# EAGLE design rooftop_reflector_v1.3 (EAGLE 9.6.2)
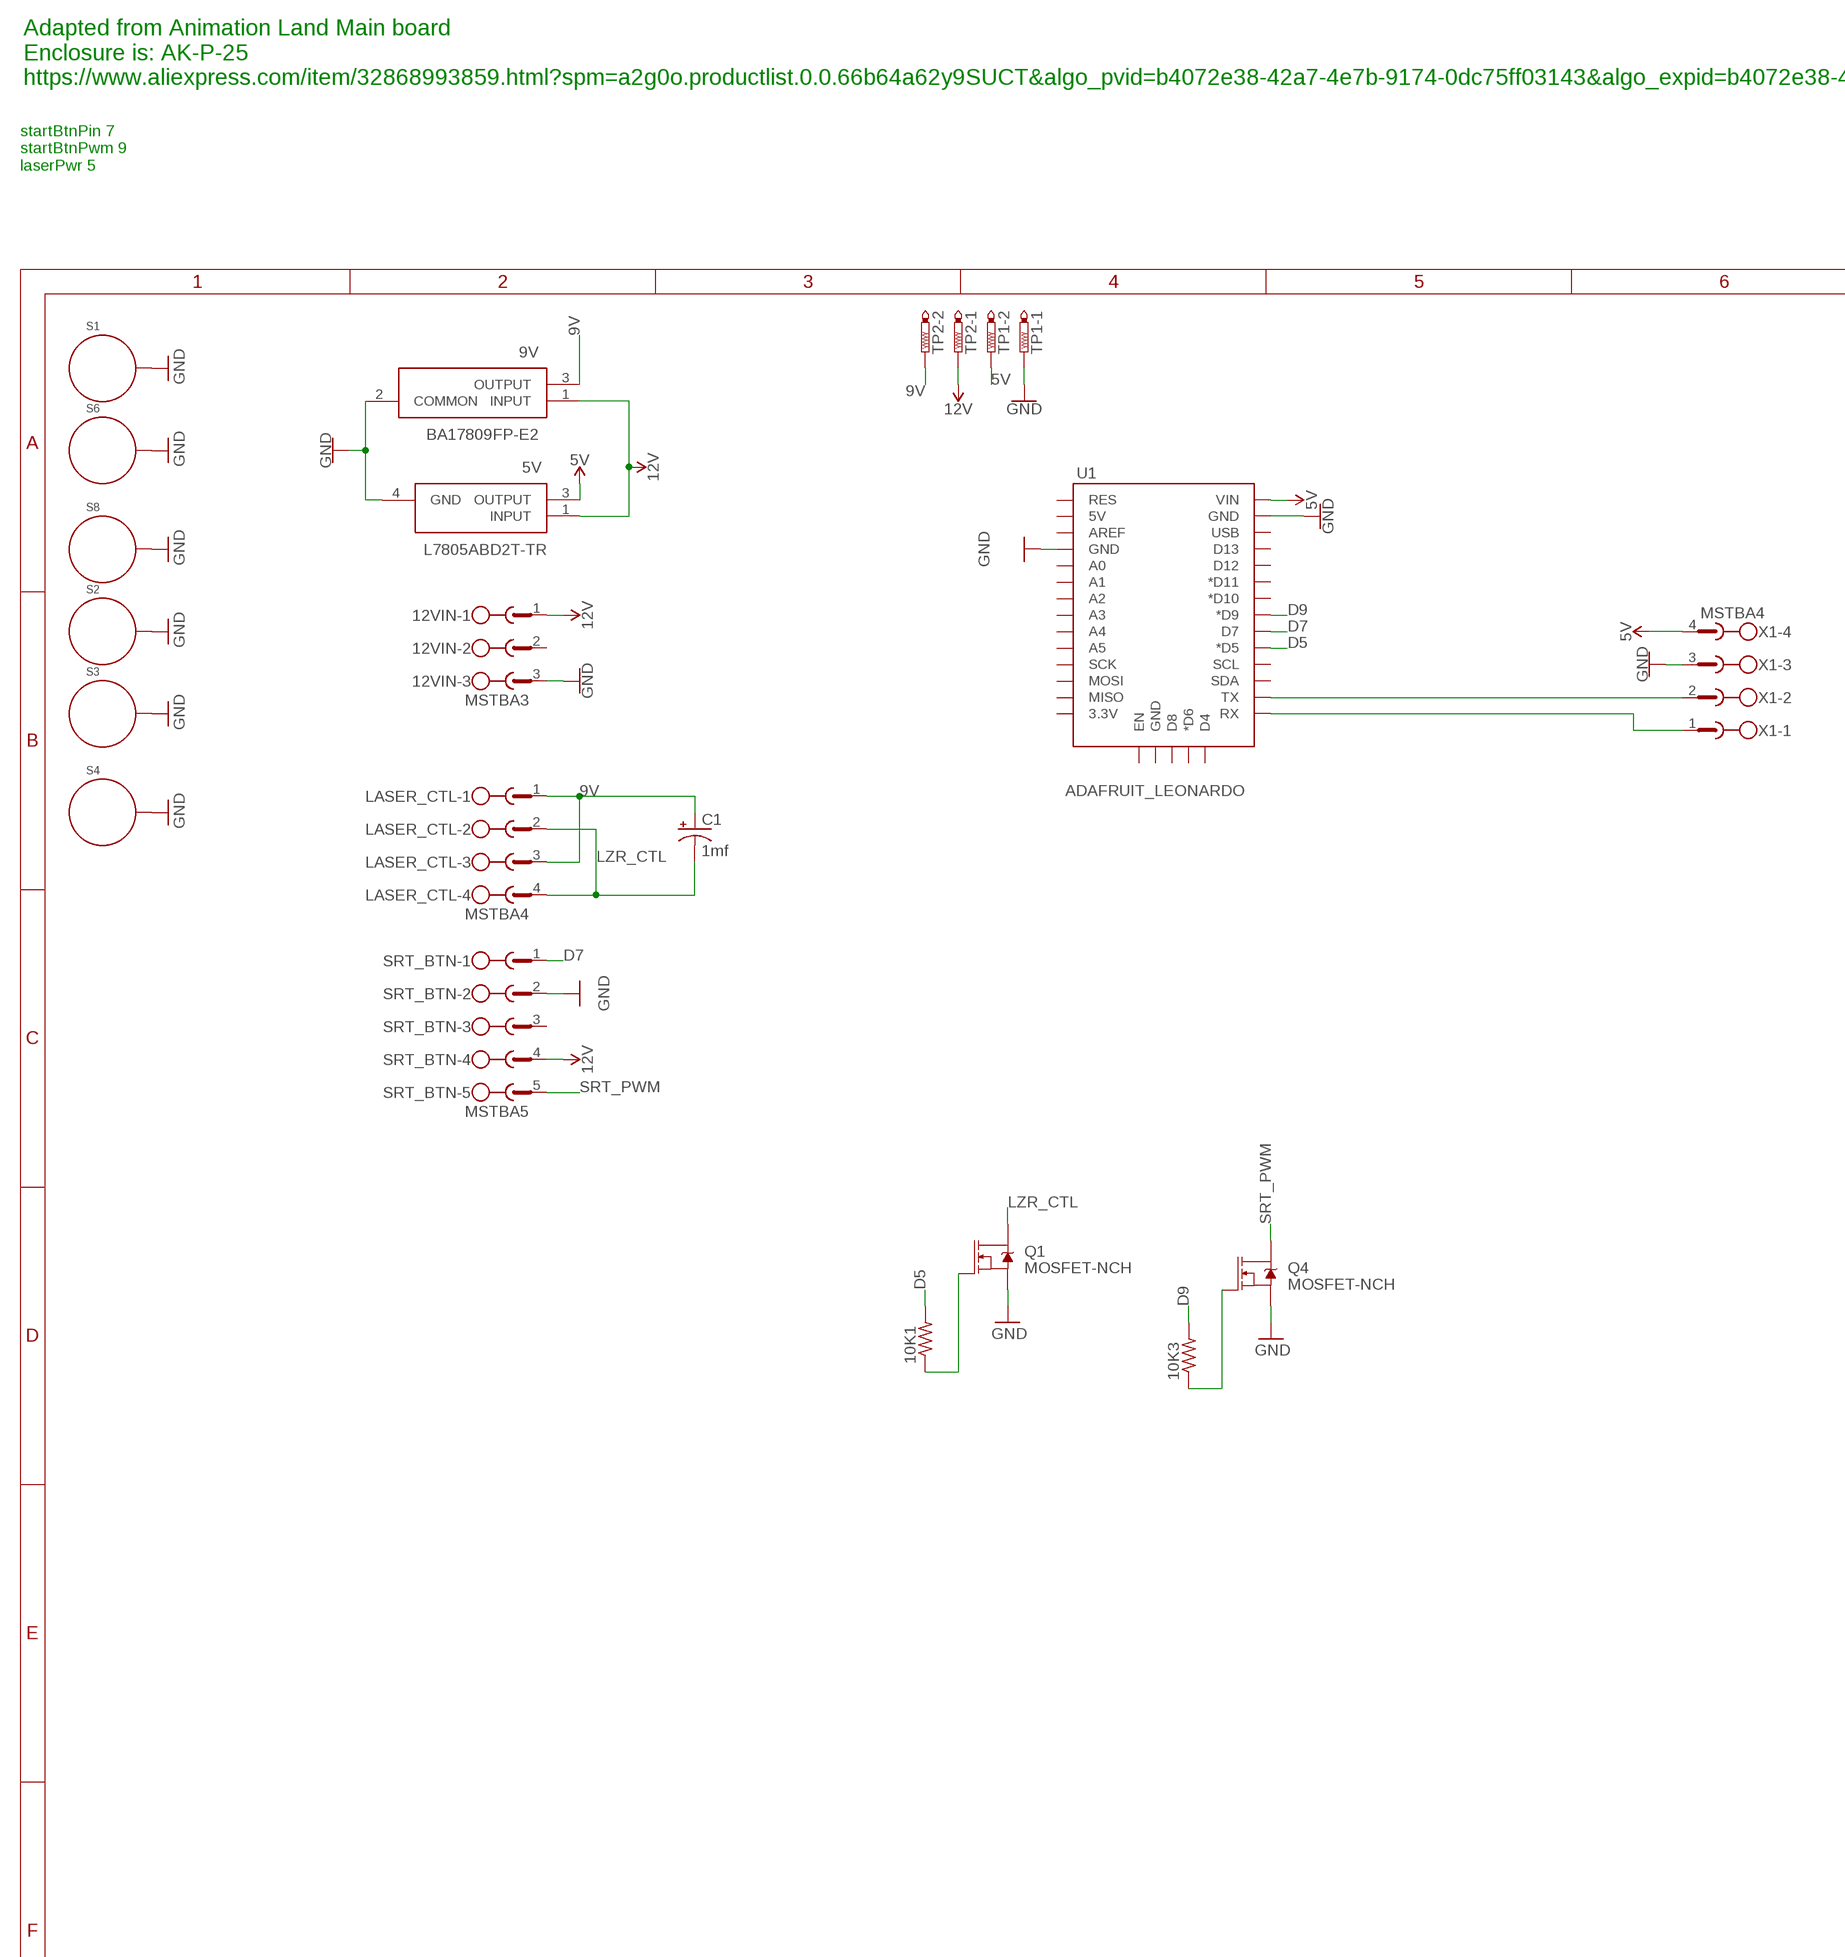
[diagram p0: schematic, sheet 1, part 1 of 2]
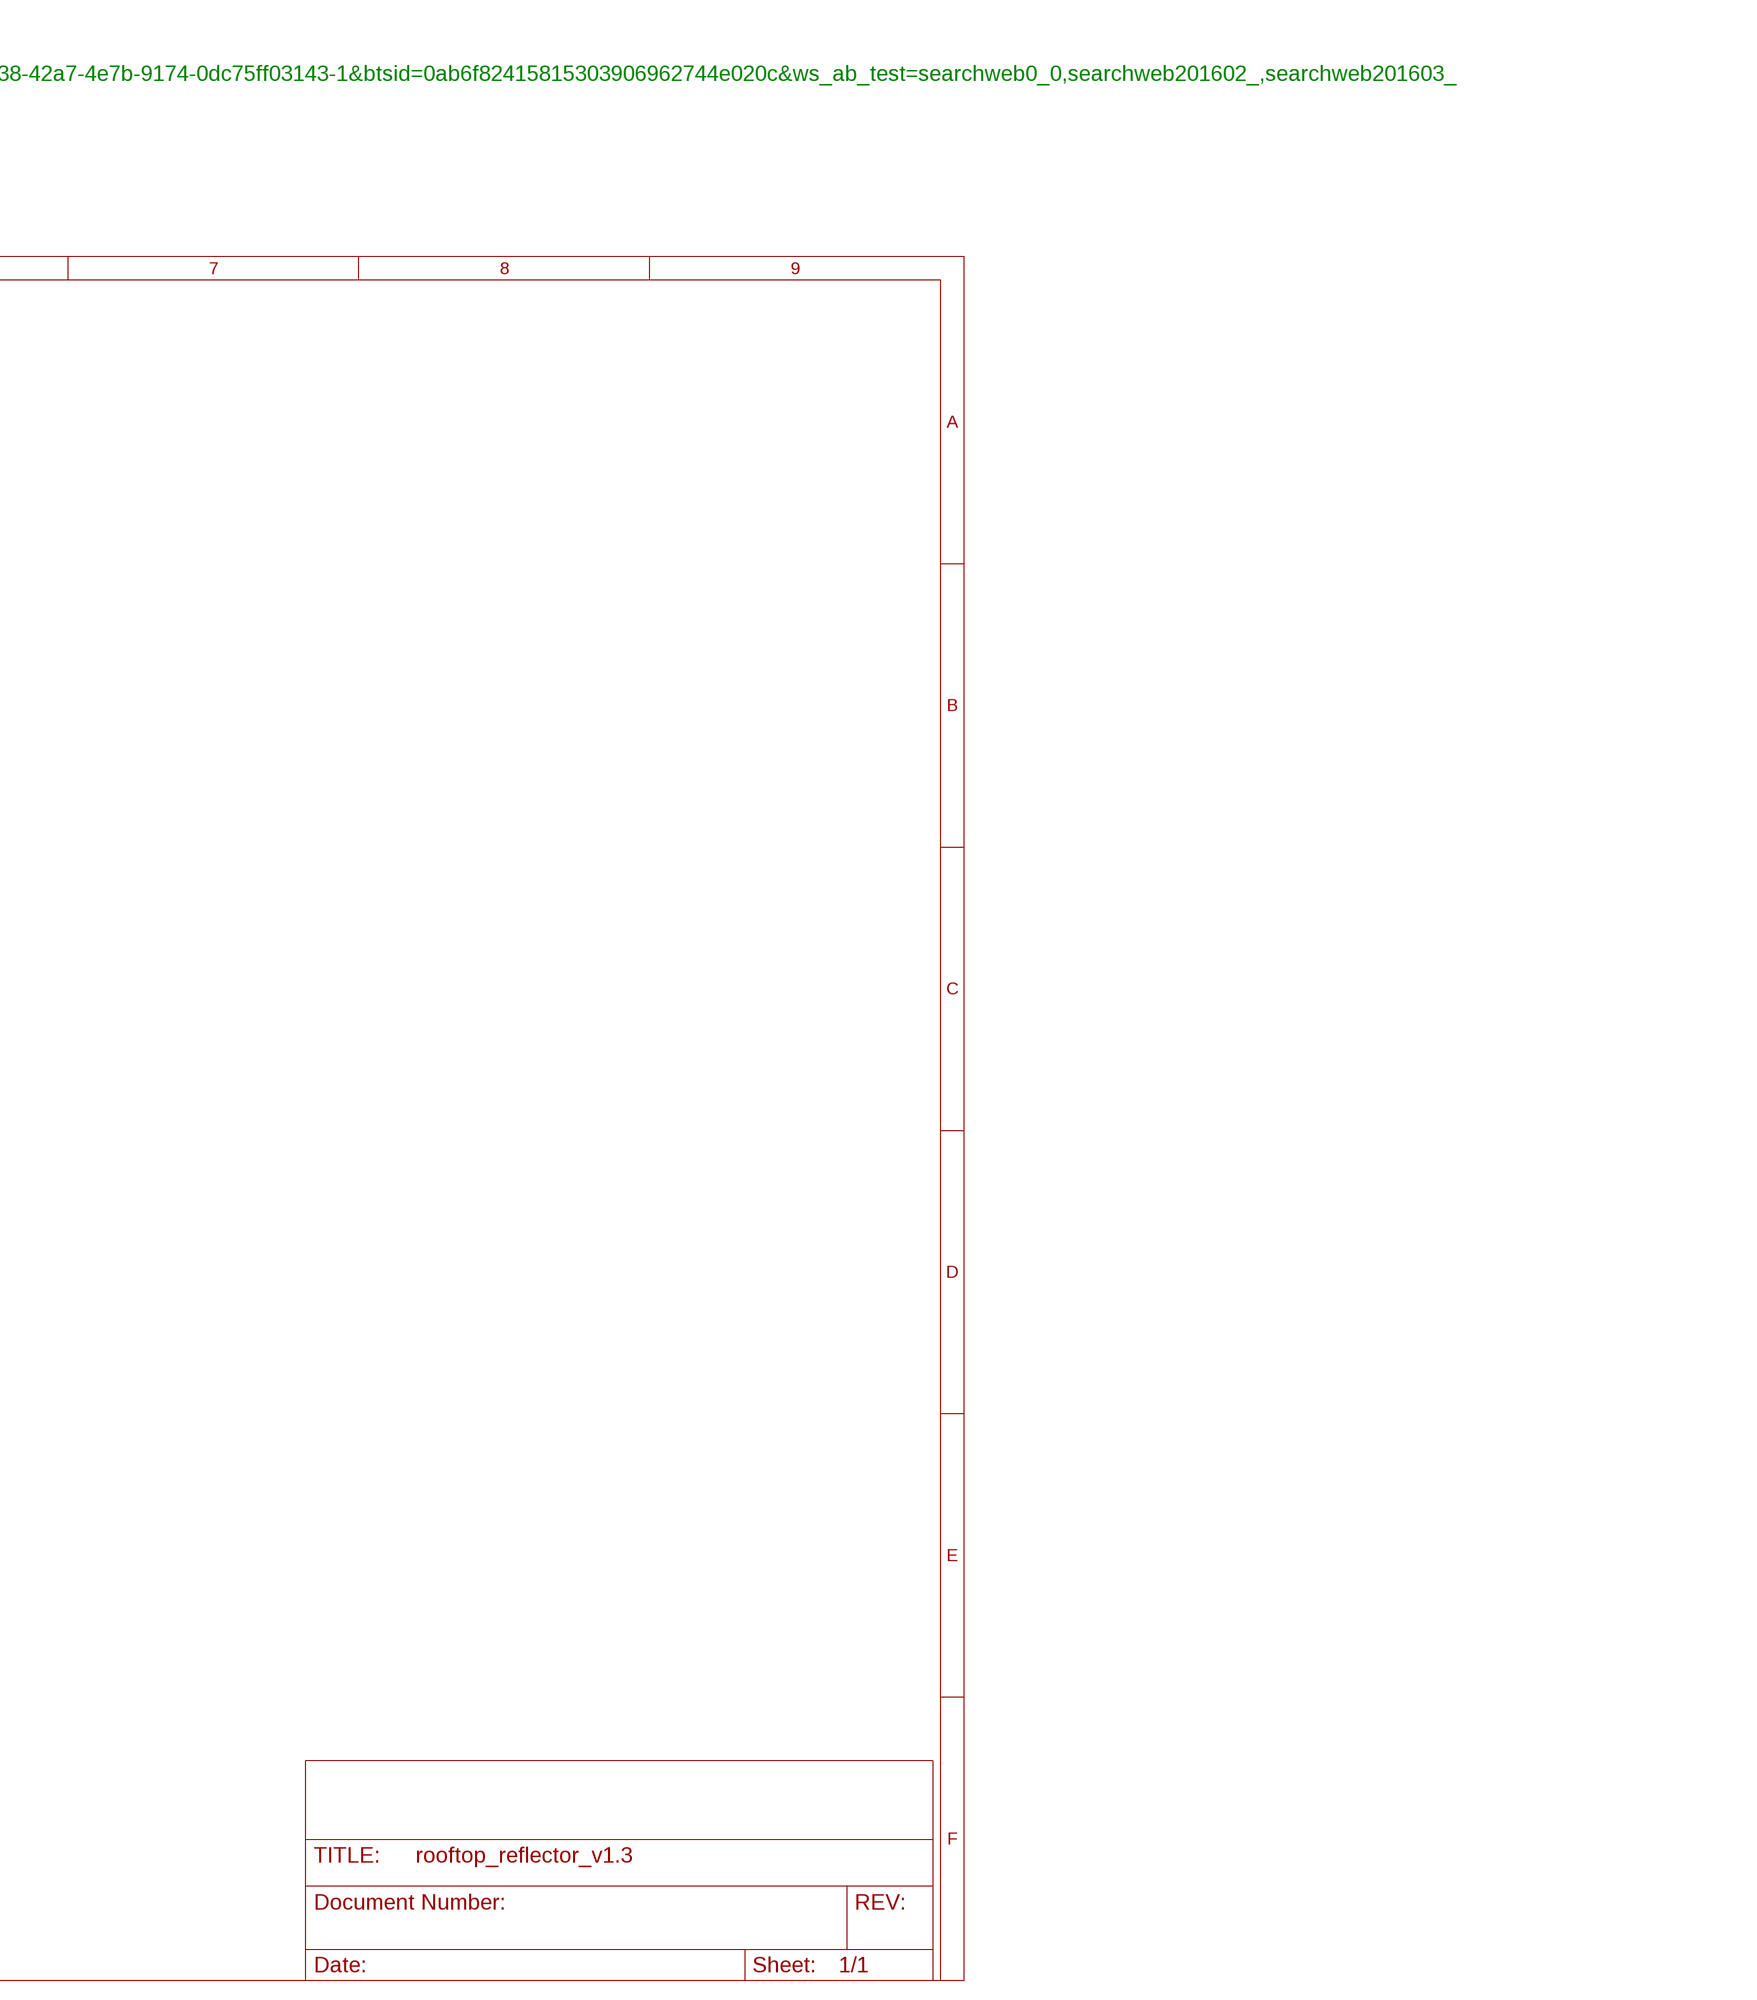
[diagram p1: schematic, sheet 1, part 2 of 2]

## Parts
5V  L7805ABD2T-TR  [D2PAK-STB35NF10T4]
9V  BA17809FP-E2  [BA17809FPE2]
10K1  R-US_M0805  [M0805]
10K3  R-US_M0805  [M0805]
12VIN  MSTBA3  [MSTBA3]
C1  1mf  CAP_RADIAL_10MM-RADIAL-5MM-25V-20%  [CAP_RADIAL_10MM]
LASER_CTL  MSTBA4  [MSTBA4]
Q1  MOSFET-NCH  [SO-8_POWER_PAK]
Q4  MOSFET-NCH  [SO-8_POWER_PAK]
S1  STANDOFF_ELECTRICAL5-32  [STANDOFF_ELECTRICAL_5_32]
S2  STANDOFF_ELECTRICAL5-32  [STANDOFF_ELECTRICAL_5_32]
S3  STANDOFF_ELECTRICAL5-32  [STANDOFF_ELECTRICAL_5_32]
S4  STANDOFF_ELECTRICAL5-32  [STANDOFF_ELECTRICAL_5_32]
S6  STANDOFF_ELECTRICAL5-32  [STANDOFF_ELECTRICAL_5_32]
S8  STANDOFF_ELECTRICAL5-32  [STANDOFF_ELECTRICAL_5_32]
SRT_BTN  MSTBA5  [MSTBA5]
TP1  PTR2  [P2-38-17]
TP2  PTR2  [P2-38-17]
U1  ADAFRUIT_LEONARDO  [ADAFRUIT_LENOARDO]
X1  MSTBA4  [MSTBA4]

## Nets
5V [High Power]: 5V.3(OUTPUT) TP1.TP-2 U1.VIN X1.4
9V [High Power]: 9V.3(OUTPUT) C1.+ LASER_CTL.1 LASER_CTL.3 TP2.TP-2
12V [High Power]: 5V.1(INPUT) 9V.1(INPUT) 12VIN.1 SRT_BTN.4 TP2.TP-1
D5 [Low Power]: 10K1.2 U1.D5(*D5)
D7 [Low Power]: SRT_BTN.1 U1.D7
D9 [Low Power]: 10K3.2 U1.D9(*D9)
GND [High Power]: 5V.4(GND) 9V.2(COMMON) 12VIN.3 Q1.S Q4.S S1.P1 S2.P1 S3.P1 S4.P1 S6.P1 S8.P1 SRT_BTN.2 TP1.TP-1 U1.GND@0(GND) U1.GND@2(GND) X1.3
LZR_CTL [Low Power]: C1.- LASER_CTL.2 LASER_CTL.4 Q1.D1(D)
N$4 [Low Power]: 10K1.1 Q1.G
N$7 [Low Power]: U1.TX X1.2
N$8 [Low Power]: U1.RX X1.1
N$27 [Low Power]: 10K3.1 Q4.G
SRT_PWM [Low Power]: Q4.D1(D) SRT_BTN.5
Unconnected: 12VIN.2 SRT_BTN.3 U1.3V(3.3V) U1.5V U1.A0 U1.A1 U1.A2 U1.A3 U1.A4 U1.A5 U1.AREF U1.D4 U1.D6(*D6) U1.D8 U1.D10(*D10) U1.D11(*D11) U1.D12 U1.D13 U1.EN U1.GND@1(GND) U1.MISO U1.MOSI U1.RES U1.SCK U1.SCL U1.SDA U1.USB

## Notes on the sheet
- Adapted from Animation Land Main board
  Enclosure is: AK-P-25
  https://www.aliexpress.com/item/32868993859.html?spm=a2g0o.productlist.0.0.66b64a62y9SUCT&algo_pvid=b4072e38-42a7-4e7b-9174-0dc75ff03143&algo_expid=b4072e38-42a7-4e7b-9174-0dc75ff03143-1&btsid=0ab6f82415815303906962744e020c&ws_ab_test=searchweb0_0,searchweb201602_,searchweb201603_
- startBtnPin 7
  startBtnPwm 9
  laserPwr 5

## Library data of the parts
5V = SamacSys_Parts:L7805ABD2T-TR: Linear Voltage Regulators 5.0V 1.0A Positive Source: Datasheet <https://www.st.com/resource/en/datasheet/l78.pdf>; DESCRIPTION: Linear Voltage Regulators 5.0V 1.0A Positive; HEIGHT: mm; MANUFACTURER_NAME: STMicroelectronics; MANUFACTURER_PART_NUMBER: L7805ABD2T-TR; MOUSER_PART_NUMBER: 511-L7805ABD2T-TR; MOUSER_PRICE-STOCK: https://www.mouser.co.uk/ProductDetail/STMicroelectronics/L7805ABD2T-TR?qs=LL%252BsqOK9SqOQ%2FfZD5ZsNqA%3D%3D
9V = SamacSys_Parts:BA17809FP-E2: Linear Voltage Regulators REGULATOR 9V Source: Datasheet <https://componentsearchengine.com/Datasheets/2/BA17809FP-E2.pdf>; DESCRIPTION: Linear Voltage Regulators REGULATOR 9V; HEIGHT: 2.5mm; MANUFACTURER_NAME: ROHM Semiconductor; MANUFACTURER_PART_NUMBER: BA17809FP-E2; MOUSER_PART_NUMBER: 755-BA17809FP-E2; MOUSER_PRICE-STOCK: https://www.mouser.co.uk/ProductDetail/ROHM-Semiconductor/BA17809FP-E2?qs=4kLU8WoGk0vE1rCq7n5Kww%3D%3D
10K1 10K3 = adafruit:R-US_: RESISTOR, American symbol
12VIN = con-phoenix-508:MSTBA3: PHOENIX; MF: FARNELL; MPN: 1757255; OC_FARNELL: 3705183; OC_NEWARK: 71C4162
C1 = OMSI_Default_V1:CAP_RADIAL_10MM: 1,000µF/1mF ceramic capacitors A capacitor is a passive two-terminal electrical component used to store electrical energy temporarily in an electric field. CAP-08070; PROD_ID: CAP-09538
LASER_CTL X1 = con-phoenix-508:MSTBA4: PHOENIX; MF: FARNELL; MPN: 1757268; OC_FARNELL: 3705195; OC_NEWARK: 71C4163
Q1 Q4 = th_ds_libraries:MOSFET-NCH: N-channel MOSFETs from Sparkfun-DiscreteSemi Library
S1-S4 S6 S8 = th_libraries:STANDOFF_ELECTRICAL: A standoff intended to be an electrically connected point. Pad size and stop size allow for a #8 Phillips pan screw head to make a solid connection to the board. Added 144mill drill hole that fits my normal wood screw
SRT_BTN = con-phoenix-508:MSTBA5: PHOENIX; MPN: 1757271; OC_FARNELL: 3705201; OC_NEWARK: 71C4164
TP1 TP2 = testpad:PTR2: TEST PIN
U1 = th_ds_libraries:ADAFRUIT_LEONARDO: Adafruit ItsyBitsy 32u4 - 5V 16MHz https://www.adafruit.com/product/3677

## Net classes
1 High Power: width 1.524 mm, drill 0.483 mm
2 Low Power: width 0.152 mm, drill 0.483 mm

## Board
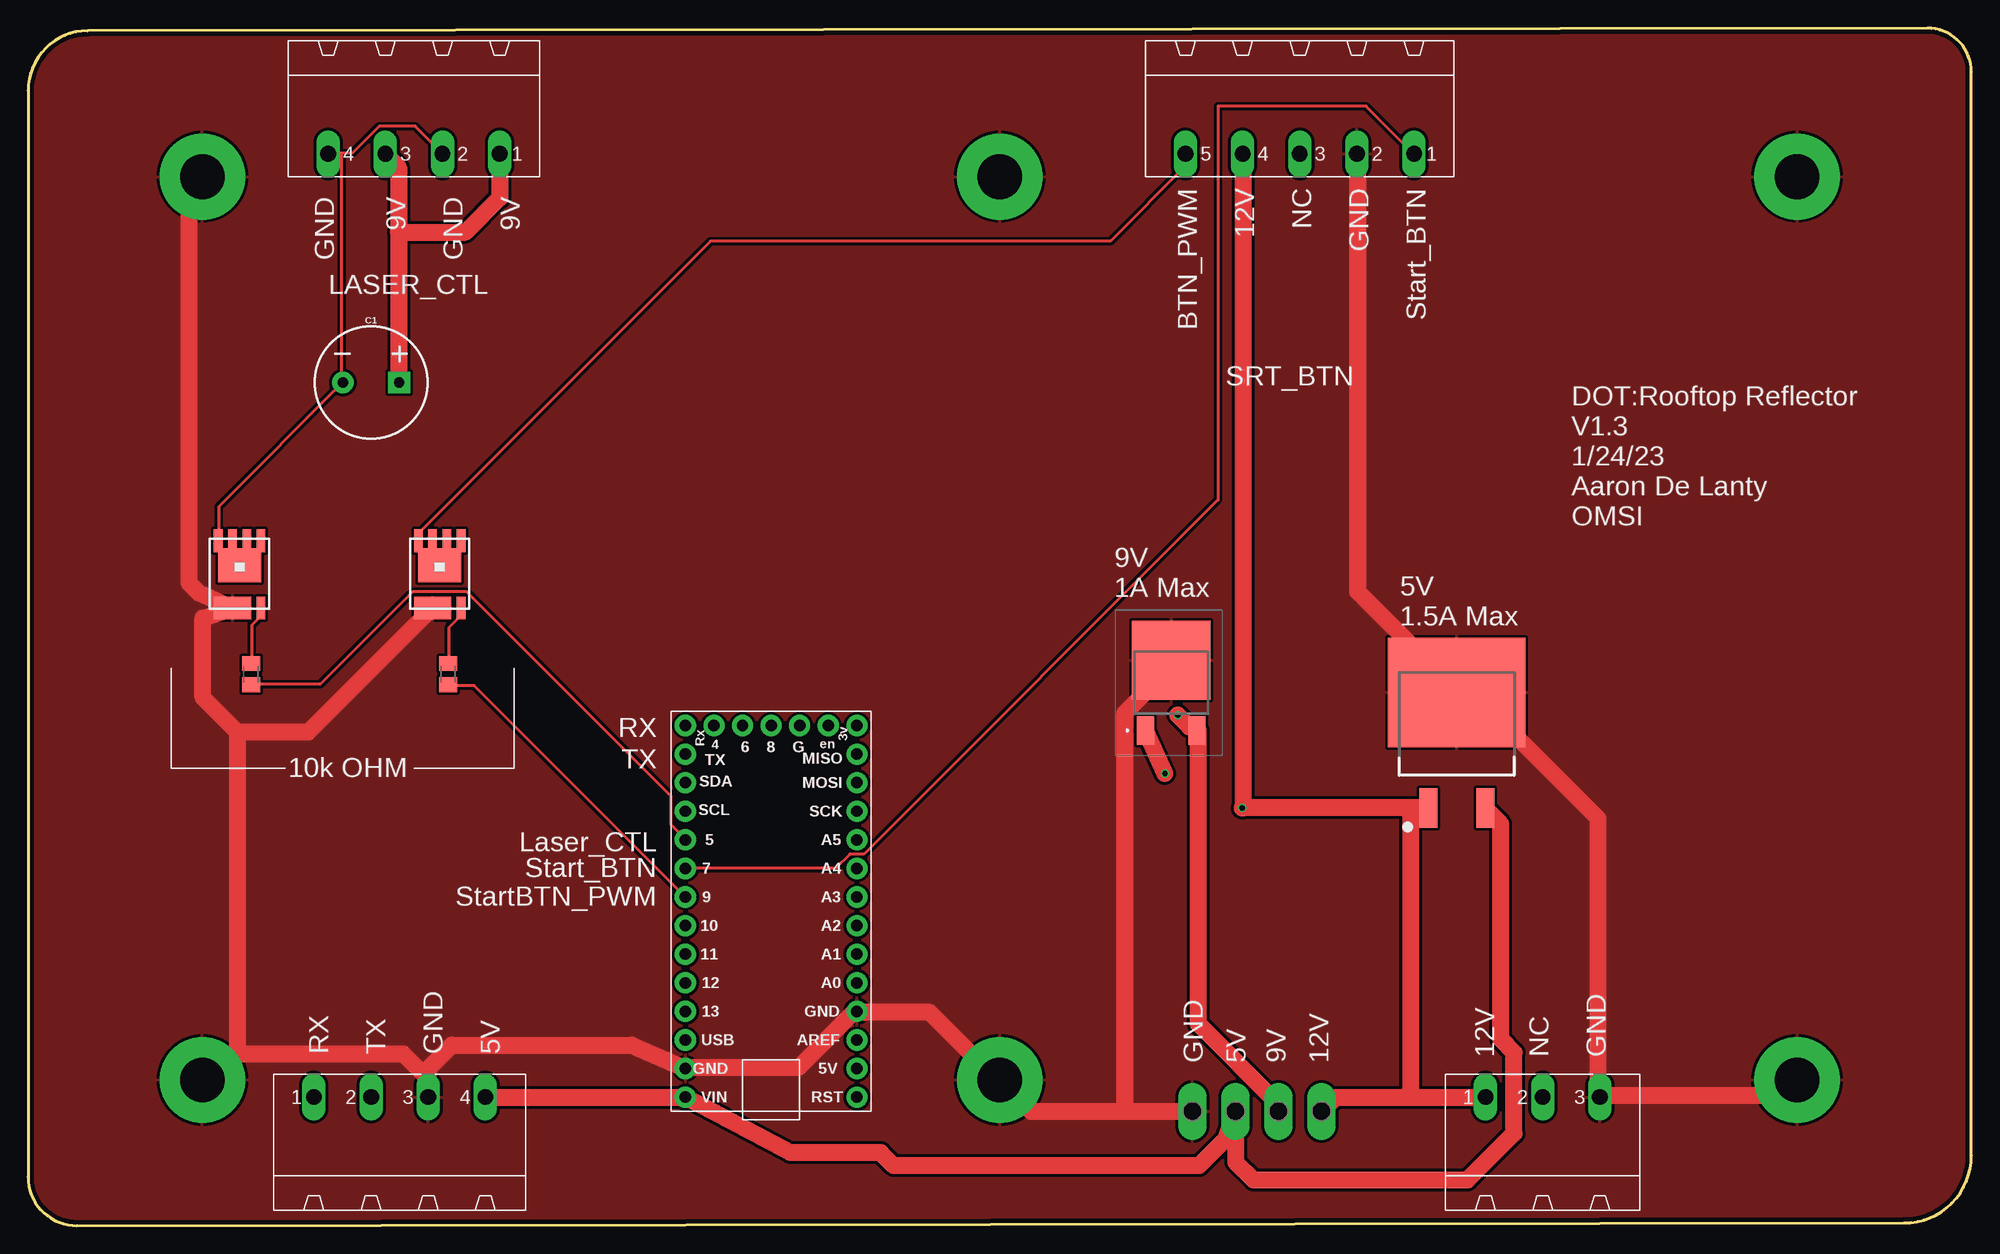
[diagram p2: board, top side]
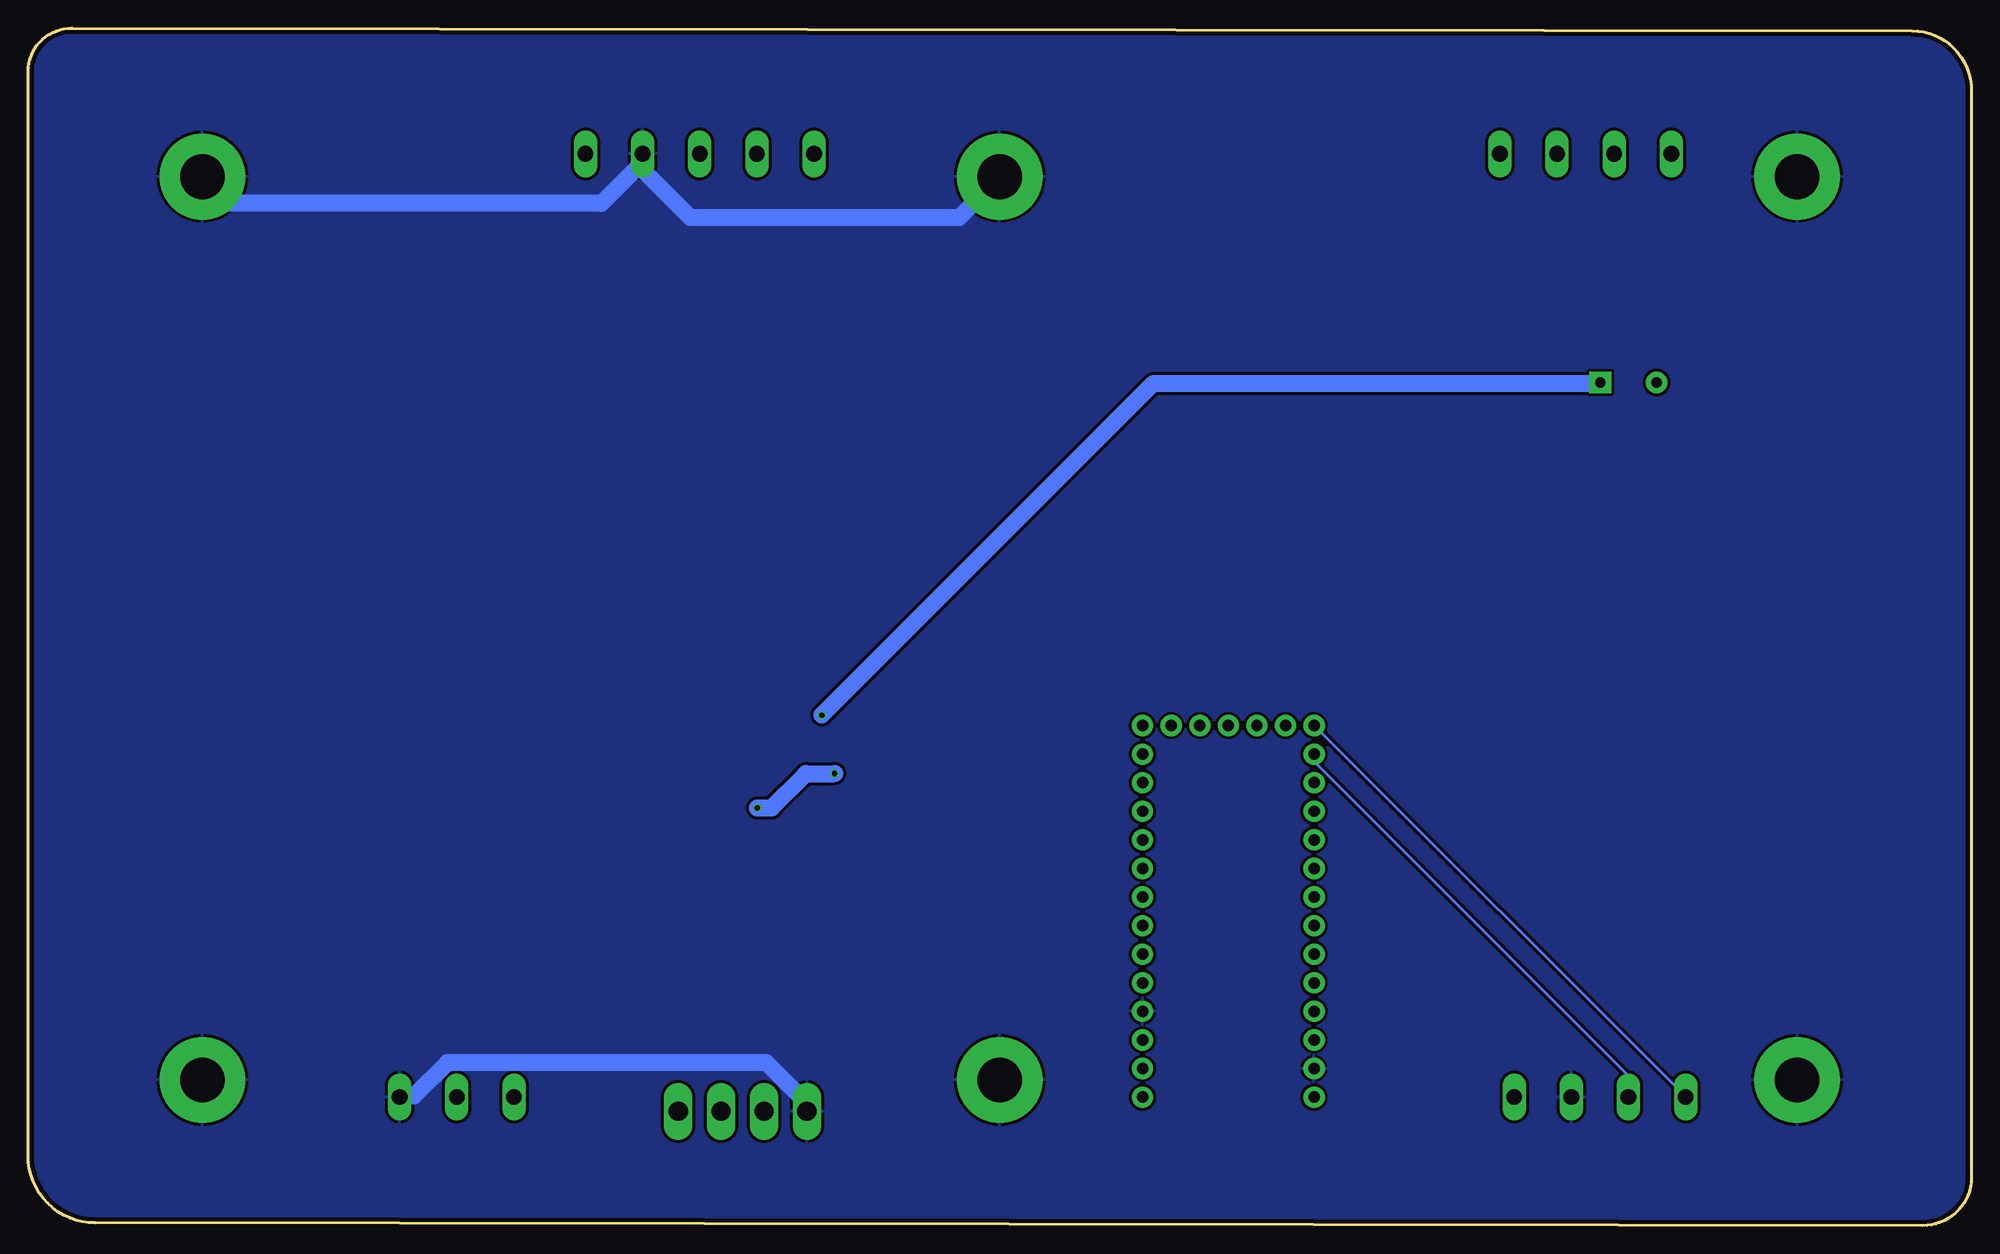
[diagram p3: board, bottom side, seen from below]

Size 172.72 x 106.41 mm. Coordinates in mm from the lower left corner, seen from the top.
Outline: 168.83,106.41 5.28,106.17 arc90 0,100.89 0,4.33 arc90 4.33,0 166.75,0.24 arc90 172.72,6.22 172.72,102.53 arc90 168.83,106.41
Copper layers (1*16): Top 0.035559375mm / dielectric 1.6mm / Bottom 0.035559375mm
Design rules "oshpark-2layer (1) *": minimum track width 10mil, minimum drill 10mil, track to track 8mil, track to pad 8mil, pad to pad 8mil, via to via 8mil, smd to smd 8mil, copper to edge 15mil, drill to drill 6mil, minimum pad ring 5mil, minimum via ring 5mil, stop-mask expansion 2.5mil, vias tented up to drill 25mil, thermal gap 10mil

### Footprints (pad centres in the part's own frame; a part is rotated, then mirrored left to right if it is on the bottom)
D2PAK-STB35NF10T4 = smd 3.5 x 1.6: 1 2.904,-7.64; 3 2.904,-2.56 | smd 9.75 x 12.2: 4 -7.371,-5.1
BA17809FPE2 = smd 1.5 x 2.5: 1 -2.3,-4.25; 3 2.3,-4.25 | smd 7 x 7: 2 0,2
M0805 = smd 1.3 x 1.6: 1 -0.95,0; 2 0.95,0
MSTBA3 = drill 1.397 long: 1 -5.08,5.08; 2 0,5.08; 3 5.08,5.08
CAP_RADIAL_10MM = drill 0.9 pad 1.93 square: + 2.5,0 | drill 0.9 pad 1.93: - -2.5,0
MSTBA4 = drill 1.397 long: 1 -7.62,5.08; 2 -2.54,5.08; 3 2.54,5.08; 4 7.62,5.08
SO-8_POWER_PAK = smd 0.762 x 2.032: D1 -3.423,2.437; D2 -2.153,2.437; D3 -0.883,2.437; D4 0.387,2.437; G 0.387,-3.532 | smd 3.81 x 3.048: D5 -1.518,0.278 | smd 3.302 x 2.032: S -2.153,-3.532
STANDOFF_ELECTRICAL_5_32 = drill 3.969 pad 7.62: P1 0,0
MSTBA5 = drill 1.397 long: 1 -10.16,5.08; 2 -5.08,5.08; 3 0,5.08; 4 5.08,5.08; 5 10.16,5.08
P2-38-17 = drill 1.702 pad 2.121 long: TP-1 -1.905,0; TP-2 1.905,0
ADAFRUIT_LENOARDO = drill 1.016 pad 1.88: 3V -10.16,-21.59; 5V -10.16,8.89; A0 -10.16,1.27; A1 -10.16,-1.27; A2 -10.16,-3.81; A3 -10.16,-6.35; A4 -10.16,-8.89; A5 -10.16,-11.43; AREF -10.16,6.35; D4 2.54,-21.59; D5 5.08,-11.43; D6 0,-21.59; D7 5.08,-8.89; D8 -2.54,-21.59; D9 5.08,-6.35; D10 5.08,-3.81; D11 5.08,-1.27; D12 5.08,1.27; D13 5.08,3.81; EN -7.62,-21.59; GND@0 -10.16,3.81; GND@1 -5.08,-21.59; GND@2 5.08,8.89; MISO -10.16,-19.05; MOSI -10.16,-16.51; RES -10.16,11.43; RX 5.08,-21.59; SCK -10.16,-13.97; SCL 5.08,-13.97; SDA 5.08,-16.51; TX 5.08,-19.05; USB 5.08,6.35; VIN 5.08,11.43

### Placement (x,y rotation side)
5V  132.08,40.02 270 top
9V  101.6,48.25 0 top
10K1  19.81,49.02 270 top
10K3  37.34,49.02 270 top
12VIN  134.62,6.34 0 top
C1  30.48,74.92 0 top
LASER_CTL  34.29,100.32 180 top
Q1  20.32,58.41 0 top
Q4  38.1,58.41 0 top
S1  15.49,93.21 0 top
S2  86.36,93.21 0 top
S3  157.23,12.95 0 top
S4  157.23,93.21 0 top
S6  86.36,12.95 0 top
S8  15.49,12.95 0 top
SRT_BTN  113.03,100.32 180 top
TP1  105.41,10.15 0 top
TP2  113.03,10.15 180 top
U1  63.5,22.85 180 top
X1  33.02,6.34 0 top

### Tracks (layer width: path | path; a pad name or v marks a point on that pad's centre or on a via)
5V
  Top 1.524: X1.4 40.69,11.41 58.41,11.41 U1.VIN 67.75,6.5 75.78,6.5 76.94,5.34 104.08,5.34 106.45,7.72 TP1.TP-2 107.33,5.66 108.91,4.07 127.94,4.07 132.07,8.2 132.07,15.39 130.89,16.57 130.89,35.7 5V.3
9V  (via drill 0.48)
  Top 1.524: 32.92,88.3 32.92,94.05 31.77,95.19 LASER_CTL.3 | 32.92,88.3 32.92,74.96 C1.+ | LASER_CTL.1 41.91,91.33 38.88,88.3 32.92,88.3 | TP2.TP-2 111.1,10.15 111.1,10.84 104.01,17.93 104.01,43.99 9V.3 103.21,44.33 v102.18,45.36
  Bottom 1.524: v102.18,45.36 72.69,74.85 33.03,74.85 C1.+
12V  (via drill 0.48)
  Top 1.524: 122.87,11.41 116.24,11.41 114.99,10.15 TP2.TP-1 | 122.87,11.41 129.5,11.41 12VIN.1 | v101.04,40.18 9V.1 | 122.87,37.13 124.36,37.13 5V.1 | 122.87,37.13 108.01,37.13 | 108.01,37.13 v107.9,37.13 | 108.01,37.13 108.01,95.19 SRT_BTN.4 | 122.87,37.13 122.87,11.41
  Bottom 1.524: v107.9,37.13 106.63,37.13 103.58,40.18 v101.04,40.18
D5
  Top 0.254: 10K1.2 19.89,48.1 25.95,48.1 34.18,56.33 38.98,56.33 57.15,38.16 57.15,35.64 58.41,34.39 U1.D5
D7
  Top 0.254: U1.D7 58.52,31.76 71.78,31.76 73.04,33.01 74.3,33.01 105.77,64.48 105.77,99.49 118.92,99.49 123.1,95.31 SRT_BTN.1
D9
  Top 0.254: 10K3.2 37.38,47.99 39.66,47.99 58.41,29.24 U1.D9
GND
  Top 1.524: S3.P1 157.16,12.9 155.79,11.53 139.79,11.53 12VIN.3 139.56,12.21 139.56,36.15 128.32,47.39 5V.4 126.53,47.99 118.19,56.33 118.19,95.19 SRT_BTN.2 | 97.5,10.15 89.15,10.15 S6.P1 85.72,13.35 80.12,18.95 74.41,18.95 U1.GND@0 73.61,18.95 73.38,18.95 68.47,14.04 58.52,14.04 U1.GND@2 53.65,16.05 37.64,16.05 35.56,13.96 X1.3 35.56,13.05 33.35,15.26 17.79,15.26 15.54,13.01 S8.P1 18.63,15.18 18.63,43.85 | 97.5,10.15 TP1.TP-1 | 97.5,10.15 97.5,45.59 101.5,49.59 101.5,50.16 9V.2 | 18.63,43.85 15.52,46.96 15.52,53.98 Q1.S 15.18,56.23 14.28,57.13 14.28,91.99 S1.P1 | 18.63,43.85 24.89,43.85 35.89,54.84 Q4.S
  Bottom 1.524: S2.P1 86.41,93.14 89.98,89.57 113.84,89.57 118.11,93.83 SRT_BTN.2 118.11,94.48 121.75,90.84 155.25,90.84 S4.P1 | 12VIN.3 139.68,11.53 138.42,11.53 135.45,14.5 107.1,14.5 103.56,10.95 103.56,10.15 TP1.TP-1
  pour Top (isolate 0.254): 0,107.94 173.25,107.94 173.25,1.79 170.18,-1.28 3.59,-1.28 arc-45 1.8,-0.53 0,1.26
  pour Bottom (isolate 0.254): 2.01,107.42 174.52,107.42 174.52,4.33 168.91,-1.28 4.86,-1.28 arc-45 3.07,-0.53 0,2.53 0,104.35 arc-45 0.74,106.15
LZR_CTL
  Top 0.254: 27.89,95.31 28.8,95.31 31.2,97.71 34.4,97.71 36.8,95.31 LASER_CTL.2 | 27.89,95.31 26.75,95.31 LASER_CTL.4 | Q1.D1 16.92,60.9 16.92,63.87 27.89,74.85 C1.- 27.89,74.96 27.89,95.31
N$4
  Top 0.254: 10K1.1 19.89,50.04 19.89,53.36 20.69,54.16 20.69,54.84 Q1.G
N$7
  Bottom 0.254: U1.TX 58.41,41.81 58.41,41.24 30.52,13.35 30.52,11.53 X1.2
N$8
  Bottom 0.254: U1.RX 58.41,44.44 25.49,11.53 X1.1
N$27
  Top 0.254: 10K3.1 37.38,50.04 37.38,53.13 38.41,54.16 38.41,54.84 Q4.G
SRT_PWM
  Top 0.254: Q4.D1 34.75,60.9 34.75,61.59 60.66,87.5 96.19,87.5 102.87,94.18 SRT_BTN.5

### Text on the board
tPlace: 10k OHM
tNames: GND | 9V | GND | 9V | BTN_PWM | 12V | NC | GND | Start_BTN | DOT:Rooftop Reflector / V1.3 / 1/24/23 / Aaron De Lanty / OMSI | 9V / 1A Max | 5V / 1.5A Max | RX | TX | Laser_CTL | Start_BTN | StartBTN_PWM | RX | TX | GND | 5V | GND | 5V | 9V | 12V | 12V | NC | GND